# EAGLE schematic ICE_module (EAGLE 5.06)
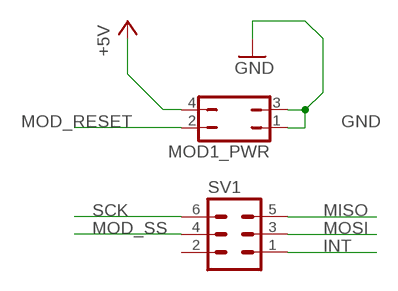
[diagram p0: schematic, sheet 1]

## Parts
MOD1_PWR  JP2Q  [JP2Q]
SV1  MA03-2  [MA03-2]

## Nets
+5V: MOD1_PWR.4
GND: MOD1_PWR.1 MOD1_PWR.3
INT: SV1.1
MISO: SV1.5
MOD_RESET: MOD1_PWR.2
MOD_SS: SV1.4
MOSI: SV1.3
SCK: SV1.6
Unconnected: SV1.2

## Library data of the parts
MOD1_PWR = jumper:JP2Q: JUMPER
SV1 = con-lstb:MA03-2: PIN HEADER